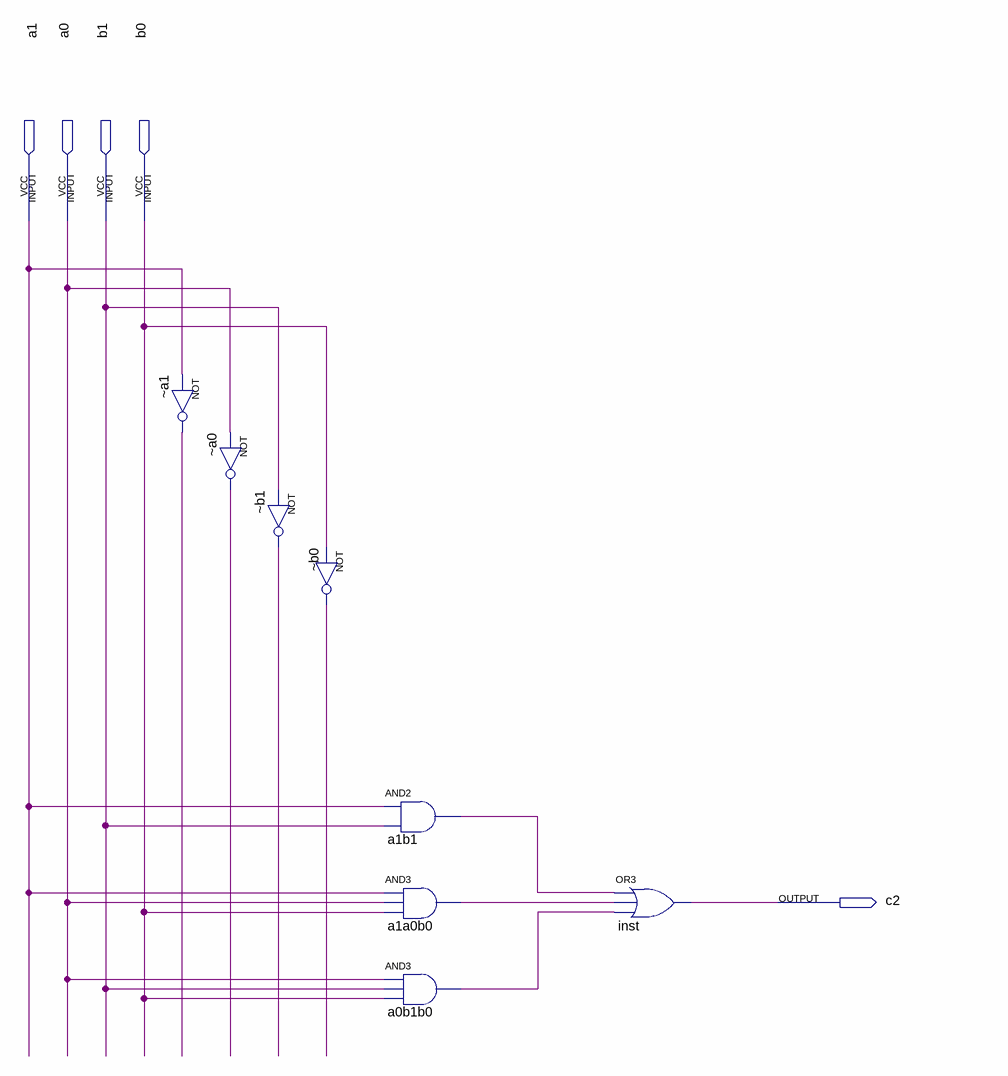
[diagram p0: schematic sheet]
// Quartus schematic c2Block.bdf as structural Verilog: 8 symbols, 5 pins
module c2Block (
  input  a1,
  input  a0,
  input  b1,
  input  b0,
  output c2
);

  wire _a0_out, _a1_out, _b0_out, _b1_out, a0b1b0_out, a1a0b0_out, a1b1_out;

  not \u_~a1  (_a1_out, a1);
  not \u_~a0  (_a0_out, a0);
  not \u_~b1  (_b1_out, b1);
  not \u_~b0  (_b0_out, b0);
  and a1b1 (a1b1_out, a1, b1);
  and a1a0b0 (a1a0b0_out, a1, a0, b0);
  and a0b1b0 (a0b1b0_out, a0, b1, b0);
  or inst (c2, a1b1_out, a1a0b0_out, a0b1b0_out);
endmodule
